# EAGLE design LoRa test (EAGLE 9.6.0)
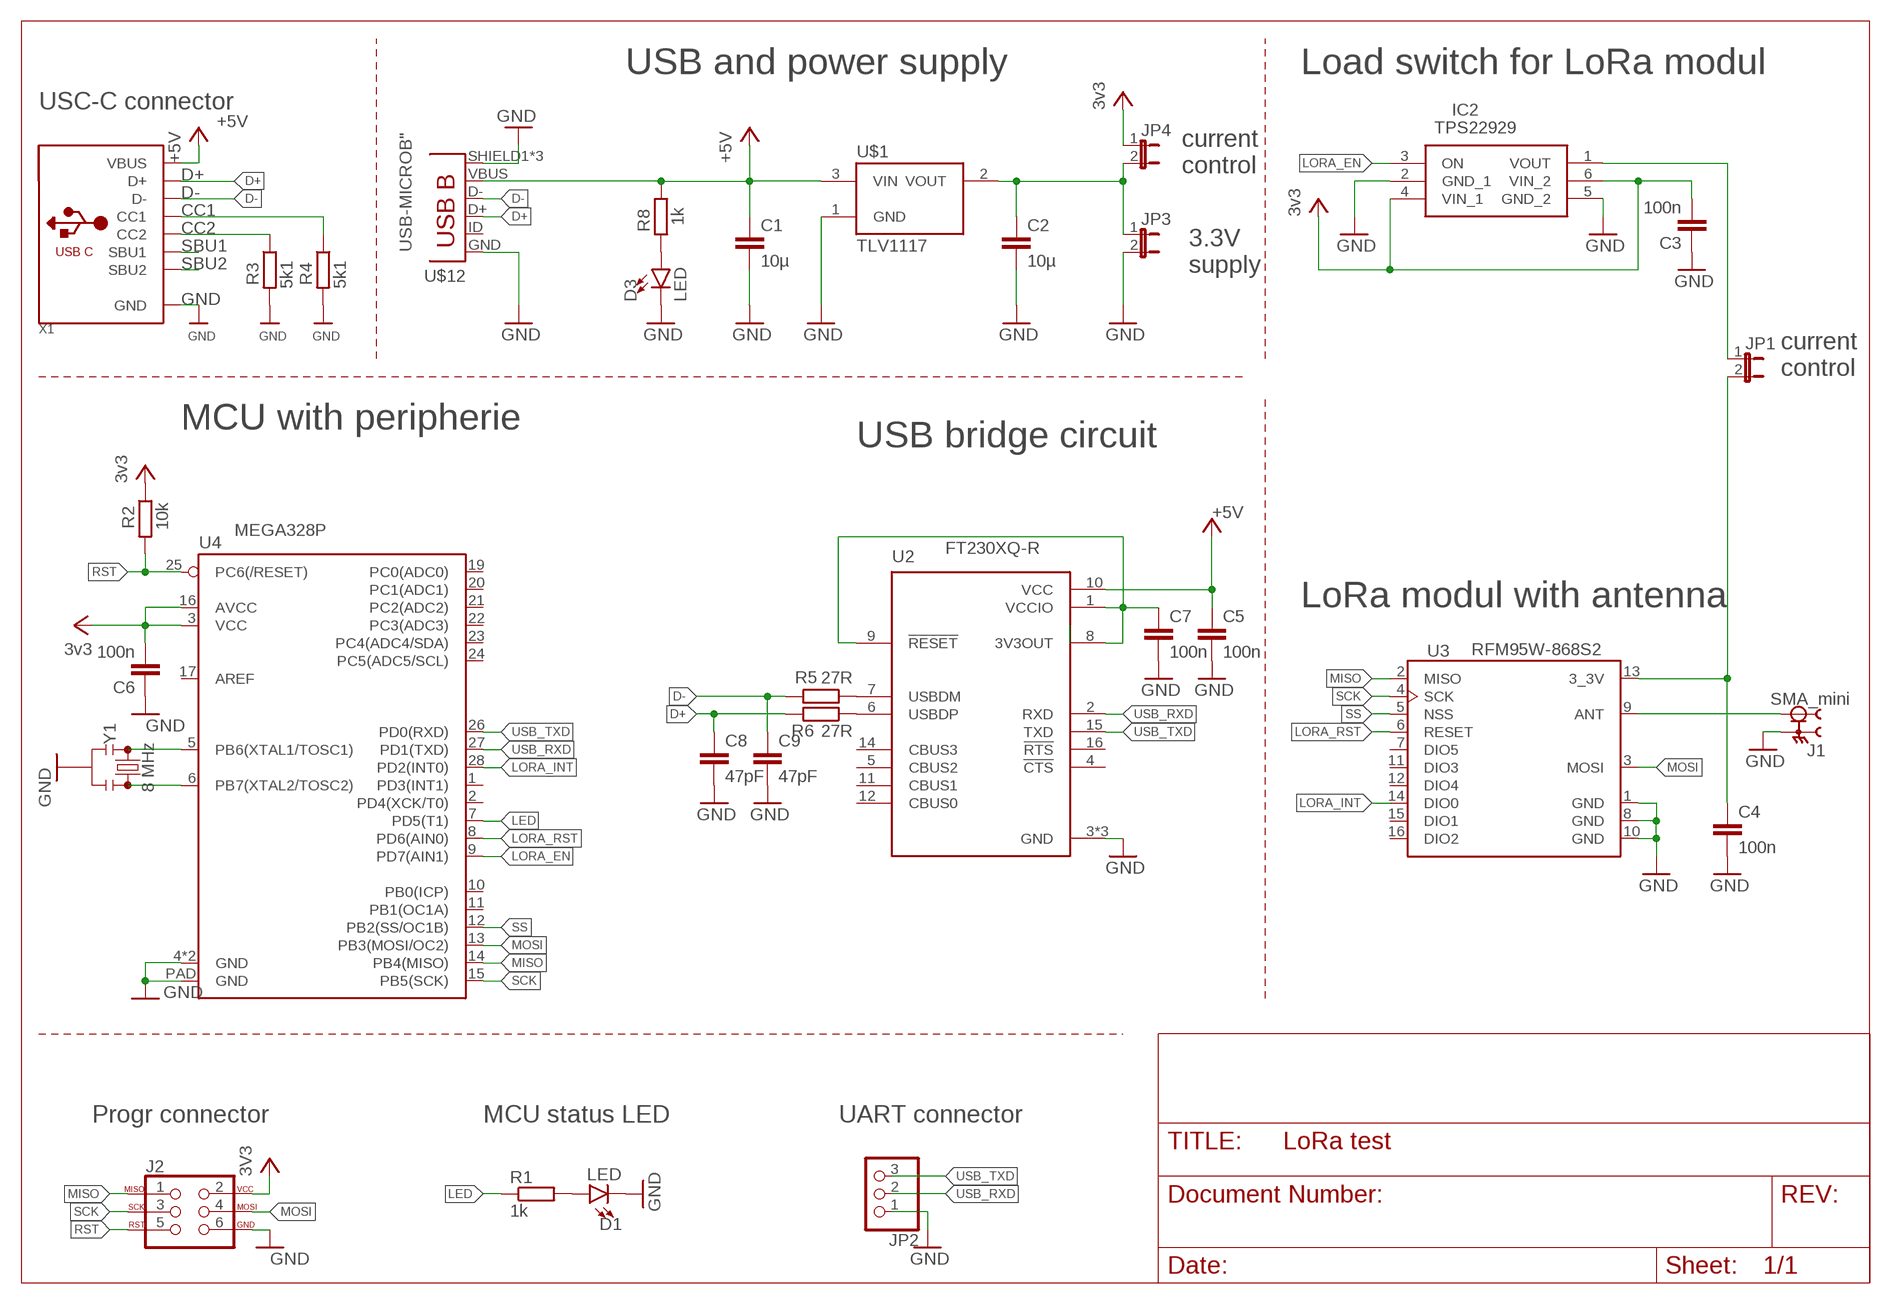
[diagram p0: schematic, sheet 1]

## Parts
C1  10µ  C-EUC1206K  [C1206K]
C2  10µ  C-EUC1206K  [C1206K]
C3  100n  C-EUC0603  [C0603]
C4  100n  C-EUC0603  [C0603]
C5  100n  C-EUC0603  [C0603]
C6  100n  C-EUC0603  [C0603]
C7  100n  C-EUC0603  [C0603]
C8  47pF  C-EUC0603  [C0603]
C9  47pF  C-EUC0603  [C0603]
D1  LED  LED-RED0603-SMART  [LED-0603]
D3  LED  LED-RED0603  [LED-0603]
IC2  TPS22929  TPS22929DDBVR  [SOP95P280X145-6N]
J1  SMA_mini  SMA_CONNECTOR  [LPRS_SMA_CONNECTOR]
J2  AVR_SPI_PROG_3X2NS  [2X3-NS]
JP1  JP1E  [JP1]
JP2  PINHD-1X3  [1X03]
JP3  JP1E  [JP1]
JP4  JP1E  [JP1]
R1  1k  R-EU_R0603  [R0603]
R2  10k  R-EU_R0603  [R0603]
R3  5k1  R-EU_R0603  [R0603]
R4  5k1  R-EU_R0603  [R0603]
R5  27R  R-EU_R0603  [R0603]
R6  27R  R-EU_R0603  [R0603]
R8  1k  R-EU_R0603  [R0603]
U2  FT230XQ-R  [QFN65P400X400X80-17N]
U3  RFM95W-868S2  [XCVR_RFM95W-868S2]
U4  MEGA328P  ATMEGA328P_VQFNVQFN  [VQFN-28]
U$1  TLV1117  [SOT223]
U$12  USB-MICROB"  [USB-B-MICRO-SMD_V03]
X1  USB_C  [USB_C_CUSB31-CFM2AX-01-X]
Y1  8 MHz  RESONATORSMD-3.2X1.3  [RESONATOR-SMD-3.2X1.3]

## Nets
+5V: C1.1 C5.1 R8.1 U2.10(VCC) U$1.3(VIN) U$12.VBUS X1.A4B9(VBUS) X1.B4A9(VBUS)
CC1: R4.1 X1.A5(CC1)
CC2: R3.1 X1.B5(CC2)
D+: C8.1 R6.2 U$12.D+ X1.A6(D+) X1.B6(D+)
D-: C9.1 R5.2 U$12.D- X1.A7(D-) X1.B7(D-)
GND: C1.2 C2.2 C3.1 C4.2 C5.2 C6.1 C7.2 C8.2 C9.2 D1.C D3.C IC2.2(GND_1) IC2.5(GND_2) J1.G1 J1.G2 J1.G3 J1.G4 J2.6 JP2.1 JP3.2 R3.2 R4.2 U2.3(GND) U2.13(GND) U2.17(GND) U3.1(GND) U3.8(GND) U3.10(GND) U4.4(GND) U4.18(GND) U4.PAD(GND) U$1.1(GND) U$12.GND U$12.SHIELD1(SHIELD) U$12.SHIELD2(SHIELD) U$12.SHIELD3(SHIELD) X1.A1B12(GND) X1.B1A12(GND) Y1.2
LED: R1.1 U4.7(PD5(T1))
LORA_EN: IC2.3(ON) U4.9(PD7(AIN1))
LORA_INT: U3.14(DIO0) U4.28(PD2(INT0))
LORA_RST: U3.6(RESET) U4.8(PD6(AIN0))
MISO: J2.1 U3.2(MISO) U4.14(PB4(MISO))
MOSI: J2.4 U3.3(MOSI) U4.13(PB3(MOSI/OC2))
N$1: D1.A R1.2
N$2: J1.1 U3.9(ANT)
N$3: R5.1 U2.7(USBDM)
N$4: IC2.1(VOUT) JP1.1
N$5: D3.A R8.2
N$6: R6.1 U2.6(USBDP)
N$7: C7.1 U2.1(VCCIO) U2.8(3V3OUT) U2.9(!RESET!)
N$8: U4.5(PB6(XTAL1/TOSC1)) Y1.1
N$9: U4.6(PB7(XTAL2/TOSC2)) Y1.3
N$10: C2.1 JP3.1 JP4.2 U$1.2(VOUT) U$1.4(VOUT2)
N$26: C4.1 JP1.2 U3.13(3_3V)
RST: J2.5 R2.2 U4.25(PC6(/RESET))
SBU1: X1.A8(SBU1)
SBU2: X1.B8(SBU2)
SCK: J2.3 U3.4(SCK) U4.15(PB5(SCK))
SS: U3.5(NSS) U4.12(PB2(SS/OC1B))
USB_RXD: JP2.2 U2.2(RXD) U4.27(PD1(TXD))
USB_TXD: JP2.3 U2.15(TXD) U4.26(PD0(RXD))
VCC: C3.2 C6.2 IC2.4(VIN_1) IC2.6(VIN_2) J2.2 JP4.1 R2.1 U4.3(VCC) U4.16(AVCC) ; supply symbol labelled 3v3, 3V3
Unconnected: U2.4(!CTS!) U2.5(CBUS2) U2.11(CBUS1) U2.12(CBUS0) U2.14(CBUS3) U2.16(!RTS!) U3.7(DIO5) U3.11(DIO3) U3.12(DIO4) U3.15(DIO1) U3.16(DIO2) U4.1(PD3(INT1)) U4.2(PD4(XCK/T0)) U4.10(PB0(ICP)) U4.11(PB1(OC1A)) U4.17(AREF) U4.19(PC0(ADC0)) U4.20(PC1(ADC1)) U4.21(PC2(ADC2)) U4.22(PC3(ADC3)) U4.23(PC4(ADC4/SDA)) U4.24(PC5(ADC5/SCL)) U$12.ID(USBID)

## Notes on the sheet
- USB and power supply | Load switch for LoRa modul
- USC-C connector
- current
  control
- 3.3V
  supply
- current
  control
- MCU with peripherie
- USB bridge circuit
- LoRa modul with antenna
- Progr connector | MCU status LED | UART connector

## Library data of the parts
C1 C2 = rcl:C-EU: CAPACITOR, European symbol; SPICEPREFIX: C
C3-C9 = rcl:C-EU: CAPACITOR, European symbol
D1 = SparkFun-LED:LED-RED: Red SMD LED Used in manufacturing of most products at SparkFun Packages: 0603 - SMD 0603 package [Product Link] <http://docs.avagotech.com/docs/AV02-0551EN> 0603 SMART - SMD 0603 SMART package ( more efficient and expensive)[Product Link] <http://www.osram-os.com/Graphics/XPic2/00077099_0.pdf> 1206 - SMD1206 package [Product Link] <https://www.sparkfun.com/datasheets/DevTools/LilyPad/Q150OVS4.pdff> SparkFun Products: Pro Mini 328 -5V <https://www.sparkfun.com/products/821> RedBoard <https://www.sparkfun.com/products/12757> IOIO-OTG <https://www.sparkfun.com/products/13613>; PROD_ID: DIO-11154; VALUE: Red
D3 = SparkFun-LED:LED-RED: Red SMD LED Used in manufacturing of most products at SparkFun Packages: 0603 - SMD 0603 package [Product Link] <http://docs.avagotech.com/docs/AV02-0551EN> 0603 SMART - SMD 0603 SMART package ( more efficient and expensive)[Product Link] <http://www.osram-os.com/Graphics/XPic2/00077099_0.pdf> 1206 - SMD1206 package [Product Link] <https://www.sparkfun.com/datasheets/DevTools/LilyPad/Q150OVS4.pdff> SparkFun Products: Pro Mini 328 -5V <https://www.sparkfun.com/products/821> RedBoard <https://www.sparkfun.com/products/12757> IOIO-OTG <https://www.sparkfun.com/products/13613>; PROD_ID: DIO-00819; VALUE: RED
IC2 = SamacSys_Parts:TPS22929DDBVR: 5.5V, 1.8A, 115m Load Switch with Quick Output Discharge and Reverse Current Protection Source: Datasheet <http://www.ti.com/lit/gpn/tps22929d>; ARROW_PART_NUMBER: TPS22929DDBVR; ARROW_PRICE-STOCK: https://www.arrow.com/en/products/tps22929ddbvr/texas-instruments; DESCRIPTION: 5.5V, 1.8A, 115m Load Switch with Quick Output Discharge and Reverse Current Protection; HEIGHT: 1.45mm; MANUFACTURER_NAME: Texas Instruments; MANUFACTURER_PART_NUMBER: TPS22929DDBVR; MOUSER_PART_NUMBER: 595-TPS22929DDBVR; MOUSER_PRICE-STOCK: https://www.mouser.co.uk/ProductDetail/Texas-Instruments/TPS22929DDBVR?qs=iuXUNOC6nYeebCTAk%2Fbsvw%3D%3D
J1 = SMA_CONNECTOR:SMA_CONNECTOR: Straight SMA Connector Check availability <https://pricing.snapeda.com/parts/SMA%20CONNECTOR/LPRS/view-part?ref=eda>; AVAILABILITY: In Stock; CHECK_PRICES: https://www.snapeda.com/parts/SMA%20CONNECTOR/LPRS/view-part/?ref=eda; DESCRIPTION: RF Coaxial Straight SMA Connector; MF: LPRS; MP: SMA CONNECTOR; PACKAGE: None; PRICE: None; SNAPEDA_LINK: https://www.snapeda.com/parts/SMA%20CONNECTOR/LPRS/view-part/?ref=snap
J2 = SparkFun-Connectors:AVR_SPI_PROG_3X2: AVR ISP 6 Pin This is the reduced ISP connector for AVR programming. Common on Arduino. This footprint will take up less PCB space and can be used with a 10-pin to 6-pin adapter such as SKU: BOB-08508 **Special note about "TEST_POINT" package. The stop mask is on the top side, so if you want your programming test points to be on the bottom of your board, make sure to place this package on the bottom side of the board. This also ensure that the orientation to program from the bottom side will be correct. SparkFun Products: SparkFun ISP Pogo Adapter <https://www.sparkfun.com/products/11591> - NS Tiny AVR Programmer <https://www.sparkfun.com/products/11801> -PTH
JP1 JP3 JP4 = jumper:JP1E: JUMPER
JP2 = pinhead:PINHD-1X3: PIN HEADER
R1-R6 R8 = rcl:R-EU_: RESISTOR, European symbol
U2 = FT230XQ-R:FT230XQ-R: USB Bridge, USB to UART USB 2.0 UART Interface 16-QFN (4x4 ) Check availability <https://pricing.snapeda.com/parts/FT230XQ-R/FTDI%2C/view-part?ref=eda>; AVAILABILITY: In Stock; CHECK_PRICES: https://www.snapeda.com/parts/FT230XQ-R/FTDI%252C+Future+Technology+Devices+International+Ltd/view-part/?ref=eda; DESCRIPTION: FT230X Series 3 Mbaud USB Full Speed to Basic UART IC with USB Charger Detection; MF: FTDI,; MP: FT230XQ-R; PACKAGE: QFN-16 FTDI; PRICE: None; PURCHASE-URL: https://www.snapeda.com/api/url_track_click_mouser/?unipart_id=51338&manufacturer=FTDI,&part_name=FT230XQ-R&search_term=uart converter; SNAPEDA_LINK: https://www.snapeda.com/parts/FT230XQ-R/FTDI%252C+Future+Technology+Devices+International+Ltd/view-part/?ref=snap
U3 = RFM95W-868S2:RFM95W-868S2: Mod Txrx Lora +20dbm 868mhz Smd Check availability <https://pricing.snapeda.com/parts/RFM95W-868S2/HOPERF/view-part?ref=eda>; AVAILABILITY: Not in stock; CHECK_PRICES: https://www.snapeda.com/parts/RFM95W-868S2/HOPERF/view-part/?ref=eda; DESCRIPTION: TRANSCEIVER, 868MHZ, FSK/OOK; RF Modulation: FSK, GFSK, GMSK, LoRa, MSK, OOK; Data Rate Max: 37.5Kbps; Frequency Max: 868MHz; Sensitivity dBm: -148dBm; Supply Voltage Min: 1.8V; Supply Voltage Max: 3.7V; Transmit Power: 20dBm; Module Interface: SPI; Supply Current: 120mA; RF Transceiver Applications: Automated Meter Reading, Wireless Sensor Networks, Wireless Alarm & Security Systems; Product Range: RFM95/96/97/98(W); SVHC: No SVHC (12-Jan-2017); MF: HOPERF; MP: RFM95W-868S2; PACKAGE: None; PRICE: None; SNAPEDA_LINK: https://www.snapeda.com/parts/RFM95W-868S2/HOPERF/view-part/?ref=snap
U4 = SparkFun-IC-Microcontroller:ATMEGA328P_VQFN: Atmel 328P QFN part not in catalog
U$1 = texas-instruments:TLV1117
U$12 = SparkFun-Connectors:USB-MICROB; PROD_ID: CONN-11752
X1 = microbuilder:USB_C: USB Type-C USB 2.0 Connector
Y1 = SparkFun-Clocks:RESONATOR: Resonators (Generic) Ceramic resonators are clock-generating components, often used to control timing in microcontrollers. They usually have 3 pins: two pins for oscillation, and one pin for ground. Compared to crystals, resonators have worse tolerance, but are usually much cheaper. Plus, they have built-in load capacitors! These devices are used on boards like the Arduino Pro 8MHz <https://www.sparkfun.com/products/11114> and Arduino Pro 16MHz <https://www.sparkfun.com/products/11113>.

## Board
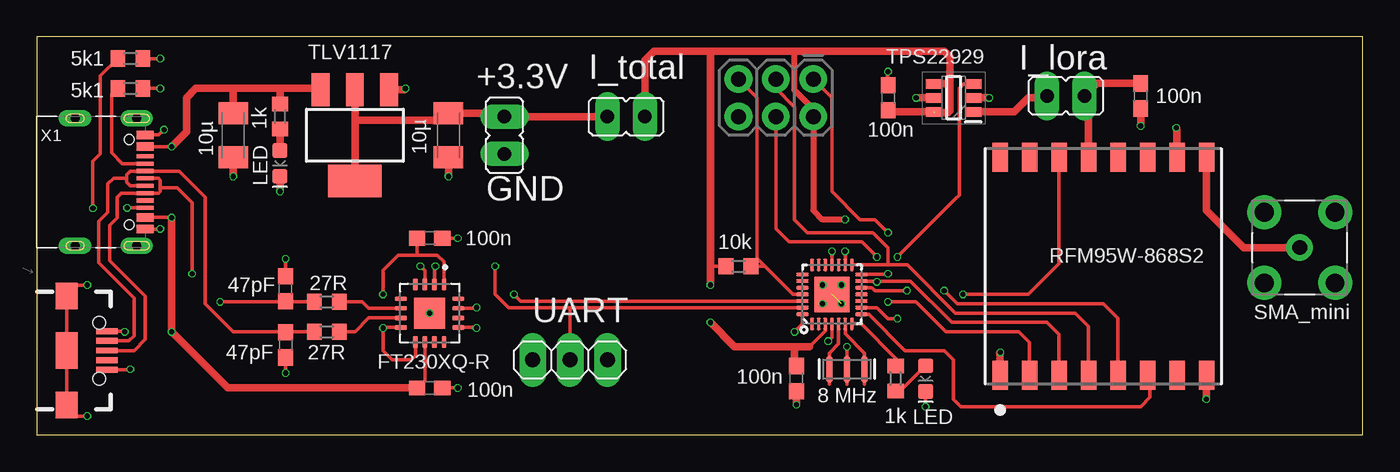
[diagram p1: board, top side]
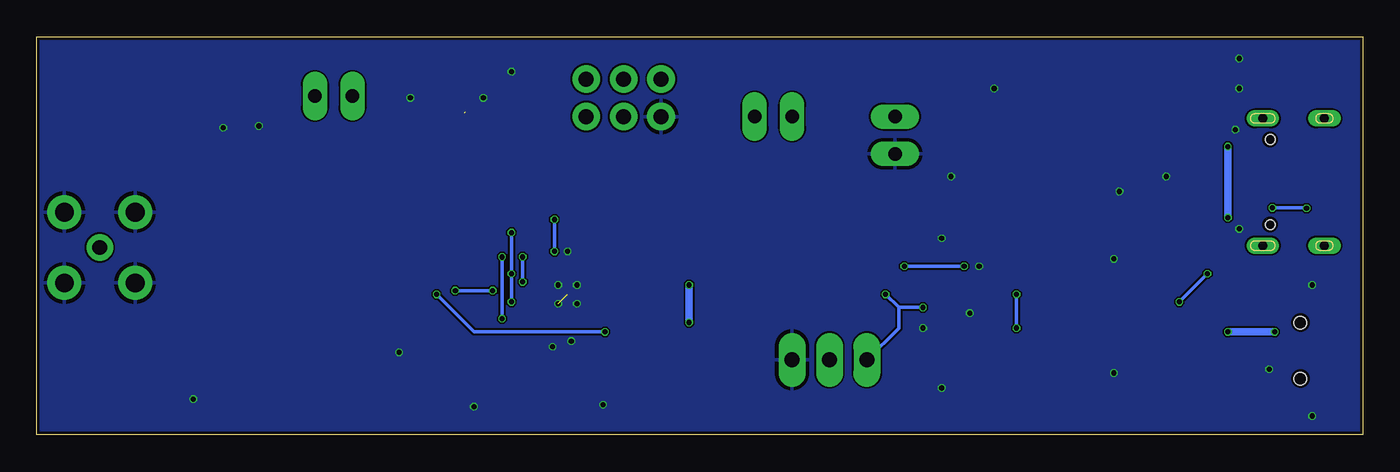
[diagram p2: board, bottom side, seen from below]

Size 90 x 27 mm. Coordinates in mm from the lower left corner, seen from the top.
Outline: 0,0 90,0 90,27 0,27 0,0
Copper layers (1*16): Top 0.035mm / dielectric 1.6mm / Bottom 0.035mm
Design rules "jlcpcb-2layers": minimum track width 5mil, minimum drill 0.3mm, track to track 5mil, track to pad 5mil, pad to pad 5mil, via to via 5mil, smd to smd 5mil, copper to edge 0.2mm, drill to drill 6mil, minimum pad ring 10mil, minimum via ring 3mil, stop-mask expansion 4mil, vias tented up to drill 0mil, thermal gap 10mil

### Footprints (pad centres in the part's own frame; a part is rotated, then mirrored left to right if it is on the bottom)
C1206K = smd 1.5 x 2: 1 -1.5,0; 2 1.5,0
C0603 = smd 1.1 x 1: 1 -0.85,0; 2 0.85,0
LED-0603 = smd 1 x 1: A -0.877,0; C 0.877,0
SOP95P280X145-6N = smd 1.075 x 0.65: 1 -1.338,0.95; 2 -1.338,0; 3 -1.338,-0.95; 4 1.338,-0.95; 5 1.338,0; 6 1.338,0.95
LPRS_SMA_CONNECTOR = drill 1: 1 0,0 | drill 1.28: G1 -2.4,2.4; G2 -2.4,-2.4; G3 2.4,-2.4; G4 2.4,2.4
2X3-NS = drill 1.016 pad 1.88: 1 -2.54,-1.27; 2 -2.54,1.27; 3 0,-1.27; 4 0,1.27; 5 2.54,-1.27; 6 2.54,1.27
JP1 = drill 0.914 long: 1 0,-1.27; 2 0,1.27
1X03 = drill 1.016 long: 1 -2.54,0; 2 0,0; 3 2.54,0
R0603 = smd 1 x 1.1: 1 -0.85,0; 2 0.85,0
QFN65P400X400X80-17N = smd 0.81 x 0.32: 1 -1.95,0.975; 2 -1.95,0.325; 3 -1.95,-0.325; 4 -1.95,-0.975; 9 1.95,-0.975; 10 1.95,-0.325; 11 1.95,0.325; 12 1.95,0.975 | smd 0.32 x 0.81: 5 -0.975,-1.95; 6 -0.325,-1.95; 7 0.325,-1.95; 8 0.975,-1.95; 13 0.975,1.95; 14 0.325,1.95; 15 -0.325,1.95; 16 -0.975,1.95 | smd 2.1 x 2.1: 17 0,0
XCVR_RFM95W-868S2 = smd 1.95 x 1.05: 1 -7.4,7; 2 -7.4,5; 3 -7.4,3; 4 -7.4,1; 5 -7.4,-1; 6 -7.4,-3; 7 -7.4,-5; 8 -7.4,-7; 9 7.4,-7; 10 7.4,-5; 11 7.4,-3; 12 7.4,-1; 13 7.4,1; 14 7.4,3; 15 7.4,5; 16 7.4,7
VQFN-28 = smd 0.82 x 0.24: 1 -2,1.35; 2 -2,0.9; 3 -2,0.45; 4 -2,0; 5 -2,-0.45; 6 -2,-0.9; 7 -2,-1.35; 15 2,-1.35; 16 2,-0.9; 17 2,-0.45; 18 2,0; 19 2,0.45; 20 2,0.9; 21 2,1.35 | smd 0.24 x 0.82: 8 -1.35,-2; 9 -0.9,-2; 10 -0.45,-2; 11 0,-2; 12 0.45,-2; 13 0.9,-2; 14 1.35,-2; 22 1.35,2; 23 0.9,2; 24 0.45,2; 25 0,2; 26 -0.45,2; 27 -0.9,2; 28 -1.35,2 | smd 2.4 x 2.4: PAD 0,0
SOT223 = smd 1.219 x 2.235: 1 -2.311,-3.099; 2 0,-3.099; 3 2.311,-3.099 | smd 3.6 x 2.2: 4 0,3.099
USB-B-MICRO-SMD_V03 = smd 1.45 x 0.4: D+ 2.725,0; D- 2.725,0.65; GND 2.725,-1.3; ID 2.725,-0.65; VBUS 2.725,1.3 | smd 1.5 x 1.8: SHIELD1 0,3.685; SHIELD2 0,-3.685 | smd 1.5 x 2.5: SHIELD3 0,0 | hole 0.85: 2.2,1.9; 2.2,-1.9
USB_C_CUSB31-CFM2AX-01-X = smd 0.575 x 1.15: A1B12 -3.2,7.355; A4B9 -2.4,7.355; B1A12 3.2,7.355; B4A9 2.4,7.355 | smd 0.275 x 1.15: A5 -1.25,7.355; A6 -0.25,7.355; A7 0.25,7.355; A8 1.25,7.355; B5 1.75,7.355; B6 0.75,7.355; B7 -0.75,7.355; B8 -1.75,7.355 | drill 0.6 pad 1 long: M1 -4.32,6.78; M2 4.32,6.78; M3 -4.32,2.6; M4 4.32,2.6 | hole 0.65: 2.89,6.28; -2.89,6.28
RESONATOR-SMD-3.2X1.3 = smd 0.45 x 1.905: 1 -1.2,0; 2 0,0; 3 1.2,0

### Placement (x,y rotation side)
C1  13.34,20.32 270 top
C2  27.94,20.32 270 top
C3  57.78,22.86 270 top
C4  74.93,22.99 270 top
C5  26.67,3.17 0 top
C6  51.56,3.81 90 top
C7  26.67,13.34 0 top
C8  16.89,9.91 90 top
C9  16.89,6.1 270 top
D1  60.33,3.81 270 top
D3  16.51,18.41 270 top
IC2  62.23,22.86 180 top
J1  85.72,12.7 270 top
J2  50.16,22.86 180 top
JP1  69.85,22.99 270 top
JP2  36.2,5.08 180 top
JP3  31.75,20.32 180 top
JP4  40.01,21.59 90 top
R1  58.29,3.81 270 top
R2  47.62,11.43 0 top
R3  6.35,25.53 0 top
R4  6.35,23.5 0 top
R5  19.68,6.99 180 top
R6  19.68,9.02 180 top
R8  16.51,21.59 270 top
U2  26.67,8.26 270 top
U3  72.39,11.43 90 top
U4  53.98,9.53 90 top
U$1  21.59,20.32 180 top
U$12  2.03,5.71 0 top
X1  0,17.14 270 top
Y1  54.99,4.45 0 top

### Tracks (layer width: path | path; a pad name or v marks a point on that pad's centre or on a via)
+5V  (via drill 0.35)
  Top 0.254: v9.14,14.73 9.13,14.74 X1.B4A9 | v9.15,19.55 X1.A4B9 | U$12.VBUS 5.94,7.01 v5.97,6.99 | C5.1 26.34,3.7 U2.10
  Top 0.508: 19.05,24.13 19.28,23.9 U$1.3 19.2,23.5 16.51,23.5 | C1.1 13.34,23.5 | R8.1 16.51,23.5 | v9.15,19.55 10.16,20.56 10.16,22.86 10.79,23.5 13.34,23.5 | v9.14,14.73 v9.14,6.99 12.95,3.17 C5.1 | 13.34,23.5 16.51,23.5
  Bottom 0.254: v9.15,19.55 v9.14,19.54
  Bottom 0.508: v9.14,19.54 v9.14,14.73 | v5.97,6.99 v9.14,6.99
CC1
  Top 0.254: X1.A5 5.81,18.39 5.08,19.12 5.08,23.11 5.46,23.5 R4.1
CC2  (via drill 0.35)
  Top 0.203: 5.21,25.53 R3.1
  Top 0.254: X1.B5 v6.12,15.39 | R3.1 4.32,24.34 4.32,19.05 3.81,18.54 v3.81,15.37
  Bottom 0.254: v6.12,15.39 3.84,15.39 v3.81,15.37
D+  (via drill 0.35)
  Top 0.254: X1.A6 8.26,17.39 8.38,17.27 8.38,16.76 | 8.38,16.76 8.38,16.51 8.27,16.39 X1.B6 5.73,16.39 5.46,16.13 5.46,14.73 4.95,14.22 4.95,11.81 7.37,9.4 7.37,6.48 6.6,5.71 U$12.D+ | 8.38,16.76 9.53,16.76 10.54,15.75 v10.54,10.92 | R6.2 16.93,9.02 C8.1 16.85,9.02 v12.45,9.02
  Bottom 0.254: v12.45,9.02 v10.54,10.92
D-
  Top 0.254: 6.1,17.4 6.1,17.65 6.34,17.89 X1.B7 9.66,17.89 11.43,16.13 11.43,8.89 13.34,6.99 16.93,6.99 | 6.1,17.4 6.1,17.14 6.35,16.89 X1.A7 | U$12.D- 6.24,6.37 6.6,6.73 6.6,9.27 4.19,11.68 4.19,14.48 4.83,15.11 4.83,17.02 5.21,17.4 6.1,17.4 | R5.2 16.93,6.99 | 16.93,6.99 C9.1
GND  (via drill 0.35)  (2 unrouted)
  Top 0.254: R3.2 v8.38,25.53 | R4.2 v8.38,23.5 | v8.38,13.97 8.36,13.95 X1.B1A12 | v8.64,20.7 8.28,20.34 X1.A1B12 | U$12.GND 6.32,4.42 v6.35,4.45 | v3.43,10.16 2.79,10.16 U$12.SHIELD1 U$12.SHIELD3 U$12.SHIELD2 2.03,1.9 2.67,1.27 v3.43,1.27 | U4.4 53.98,6.6 v53.72,6.35 | Y1.2 v54.99,5.97 | C7.2 v28.57,13.34 | D1.C v60.33,1.91 | U4.18 v53.98,12.45 | C3.1 57.75,23.75 57.75,24.6 v57.78,24.64 | U2.13 29.8,7.28 v29.84,7.24 | U2.3 26.34,11.12 v26.04,11.43 | C8.2 v16.89,11.94 | C9.2 v16.89,4.19 | C5.2 v28.57,3.17
  Top 0.508: C2.2 v27.94,17.53 | v25.02,23.5 24.94,23.42 U$1.1 | D3.C v16.51,16.51 | C1.2 v13.34,17.53 | U3.10 77.39,20.78 v77.34,20.83 | U3.8 79.39,2.43 v79.38,2.41 | U3.1 65.39,5.57 v65.41,5.59 | C4.2 v74.93,20.95 | IC2.2 v64.64,22.86 | IC2.5 v59.69,22.86 | C6.1 v51.56,2.03
  other vias: 53.34,10.16 54.61,10.16 53.34,8.89 54.61,8.89 26.67,8.26
  pour Bottom: 0,27 0,0 90,0 90,27
LED
  Top 0.254: U4.7 55.98,7.53 58.33,5.17 R1.1
LORA_EN  (via drill 0.35)
  Top 0.254: U4.9 57.03,8.62 57.78,7.87 v58.42,7.87 | 63.63,23.88 IC2.3 62.93,23.81 62.61,23.5 62.61,16.26 62.36,16 62.23,15.88 v58.42,12.06
  Bottom 0.254: v58.42,7.87 v58.42,12.06
LORA_INT  (via drill 0.35)
  Top 0.254: U3.14 69.39,11.61 67.31,9.53 v62.87,9.53 | U4.28 51.98,7.53 v51.44,6.99
  Bottom 0.254: v51.44,6.99 60.33,6.99 v62.87,9.53
LORA_RST
  Top 0.254: U4.8 56.47,8.18 58.93,5.71 61.59,5.71 62.23,5.08 62.23,2.41 62.74,1.91 74.93,1.91 75.56,2.54 75.56,3.85 U3.6
MISO  (via drill 0.35)
  Top 0.254: U3.2 67.39,6.27 66.67,6.99 61.72,6.99 59.69,9.02 v57.78,9.02 | U4.14 57.74,10.88 v57.78,10.92 | J2.1 53.98,22.86 53.98,16.51 55.88,14.61 56.9,14.61 v57.78,13.72
  Bottom 0.254: v57.78,9.02 v57.78,10.92 v57.78,13.72
MOSI  (via drill 0.35)
  Top 0.254: U3.3 69.39,6.81 68.58,7.62 62.1,7.62 59.31,10.41 56.98,10.41 | U4.13 56.97,10.43 56.98,10.41 | 56.98,10.41 v57.02,10.37 | v57.02,12.06 56.01,13.08 51.05,13.08 50.16,13.97 J2.4
  Bottom 0.254: 57.02,10.41 v57.02,10.37 v57.02,12.06
N$1
  Top 0.254: R1.2 58.6,2.96 D1.A
N$2
  Top 0.508: J1.1 81.92,12.7 79.38,15.24 79.38,18.82 U3.9
N$3
  Top 0.254: U2.7 22.54,7.93 21.59,6.99 R5.1
N$4
  Top 0.508: JP1.1 68.45,22.86 67.31,22.86 66.36,21.91 IC2.1
N$5
  Top 0.508: R8.2 D3.A
N$6
  Top 0.254: U2.6 22.54,8.58 22.1,9.02 R6.1
N$7  (via drill 0.35)
  Top 0.254: U2.9 25.7,5.38 25.4,5.08 24.13,5.08 23.5,5.71 v23.5,7.24 23.54,7.28 U2.8 | v23.5,9.53 23.5,11.18 24.51,12.19 25.78,12.19 | U2.1 27.64,11.72 27.18,12.19 25.78,12.19 | C7.1 25.82,12.23 25.78,12.19
  Bottom 0.254: v23.5,7.24 v23.5,9.53
N$8
  Top 0.254: U4.5 54.42,6.17 53.79,5.53 Y1.1
N$9
  Top 0.254: Y1.3 56.19,5.53 54.88,6.85 U4.6
N$10
  Top 0.508: U$1.4 21.59,21.34 | 21.59,21.34 U$1.2 | 21.59,21.34 27.46,21.34 C2.1 31.52,21.82 JP3.1 JP4.2
N$26
  Top 0.508: C4.1 71.97,23.84 JP1.2 71.39,22.72 U3.13
RST
  Top 0.254: J2.5 48.9,22.86 48.9,11.97 49.44,11.43 | U4.25 51.34,9.53 49.53,11.34 49.44,11.43 | R2.2 49.44,11.43
SCK
  Top 0.254: U3.4 71.39,7.35 70.48,8.26 62.36,8.26 59.09,11.53 57.78,11.53 | 57.78,11.53 U4.15 | J2.3 50.16,23.5 51.44,22.23 51.44,14.61 52.32,13.72 56.77,13.72 57.78,12.7 57.78,11.53
SS  (via drill 0.35)
  Top 0.254: U3.5 73.39,7.89 72.39,8.89 62.48,8.89 v61.59,9.78 | U4.12 56.7,9.97 56.9,9.78 v59.05,9.78
  Bottom 0.254: v61.59,9.78 v59.05,9.78
USB_RXD  (via drill 0.35)
  Top 0.254: U2.2 27,11.37 v27.05,11.43 | v31.11,11.43 31.11,9.53 32.02,8.62 36.32,8.62 | U4.27 36.32,8.62 | JP2.2 36.2,8.5 36.32,8.62
  Bottom 0.254: v27.05,11.43 v31.11,11.43
USB_TXD  (via drill 0.35)
  Top 0.254: v29.85,8.64 29.79,8.58 U2.15 | v32.38,9.53 32.84,9.07 U4.26
  Bottom 0.152: 31.5,8.64
  Bottom 0.254: v32.38,9.53 31.5,8.64 | 31.5,8.64 v29.85,8.64 | JP2.3 31.5,7.24 31.5,8.64
VCC  (via drill 0.35)  (1 unrouted)
  Top 0.254: U4.3 53.52,7.04 52.45,5.97 | U4.16 54.88,12.44 v54.86,12.45 | R2.1 45.72,11.43
  Top 0.406: 51.44,26.04 51.44,23.37 52.7,22.1 J2.2 52.7,15.24 53.34,14.61 v54.86,14.61
  Top 0.508: 61.98,23.75 61.91,23.81 IC2.4 | 61.98,23.75 61.98,21.97 61.85,21.84 60.96,21.84 | 51.66,4.76 C6.2 51.44,4.79 51.44,5.97 | JP4.1 41.27,25.4 41.91,26.04 45.72,26.04 | 45.72,26.04 51.44,26.04 61.59,26.04 61.98,25.65 61.98,23.75 | 45.72,26.04 45.72,11.43 v45.72,10.16 | 51.44,5.97 52.45,5.97 | 51.44,5.97 47.37,5.97 v45.72,7.62 | IC2.6 57.88,21.91 C3.2
  Bottom 0.254: v54.86,12.45 v54.86,14.61
  Bottom 0.508: v45.72,10.16 v45.72,7.62

### Text on the board
tPlace: I_lora | I_total | +3.3V | GND | UART